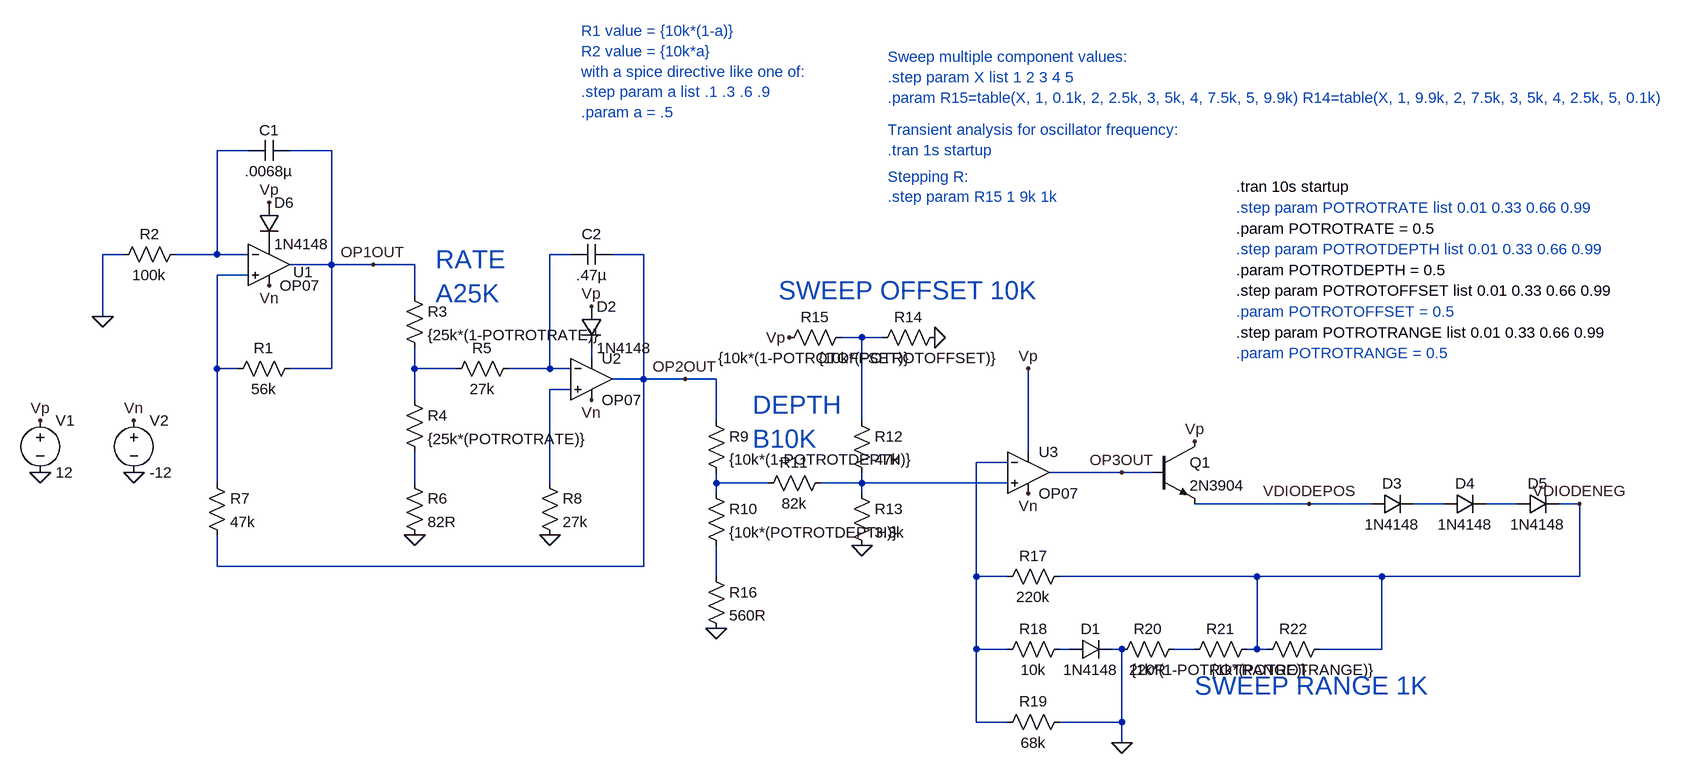
[diagram p0: schematic oscillator_fixed_extended.asc]
oscillator_fixed_extended.asc, the LTspice schematic file:
Version 4
SHEET 1 2688 968
WIRE 112 16 64 16
WIRE 240 16 176 16
WIRE -80 176 -112 176
WIRE 64 176 64 16
WIRE 64 176 0 176
WIRE 112 176 64 176
WIRE 608 176 576 176
WIRE 720 176 672 176
WIRE 240 192 240 16
WIRE 240 192 176 192
WIRE 304 192 240 192
WIRE 368 192 304 192
WIRE 112 208 64 208
WIRE 368 240 368 192
WIRE -112 272 -112 176
WIRE 1056 304 1024 304
WIRE 1088 304 1056 304
WIRE 640 336 640 320
WIRE 64 352 64 208
WIRE 96 352 64 352
WIRE 240 352 240 192
WIRE 240 352 176 352
WIRE 368 352 368 320
WIRE 432 352 368 352
WIRE 576 352 576 176
WIRE 576 352 512 352
WIRE 608 352 576 352
WIRE 720 368 720 176
WIRE 720 368 672 368
WIRE 784 368 720 368
WIRE 832 368 784 368
WIRE 608 384 576 384
WIRE 368 400 368 352
WIRE 832 432 832 368
WIRE 1056 432 1056 304
WIRE 1312 480 1312 352
WIRE 1280 496 1232 496
WIRE 1456 512 1344 512
WIRE 1504 512 1456 512
WIRE 64 528 64 352
WIRE 368 528 368 480
WIRE 576 528 576 384
WIRE 832 528 832 512
WIRE 912 528 832 528
WIRE 1056 528 1056 512
WIRE 1056 528 992 528
WIRE 1280 528 1056 528
WIRE 832 544 832 528
WIRE 1056 544 1056 528
WIRE 1744 560 1568 560
WIRE 1840 560 1744 560
WIRE 1952 560 1904 560
WIRE 2064 560 2016 560
WIRE 2160 560 2128 560
WIRE 64 656 64 608
WIRE 720 656 720 368
WIRE 720 656 64 656
WIRE 832 672 832 624
WIRE 1232 672 1232 496
WIRE 1280 672 1232 672
WIRE 1664 672 1360 672
WIRE 1856 672 1664 672
WIRE 2160 672 2160 560
WIRE 2160 672 1856 672
WIRE 1232 784 1232 672
WIRE 1280 784 1232 784
WIRE 1376 784 1360 784
WIRE 1456 784 1440 784
WIRE 1568 784 1536 784
WIRE 1664 784 1664 672
WIRE 1664 784 1648 784
WIRE 1680 784 1664 784
WIRE 1856 784 1856 672
WIRE 1856 784 1760 784
WIRE 1232 896 1232 784
WIRE 1280 896 1232 896
WIRE 1456 896 1456 784
WIRE 1456 896 1360 896
WIRE 1456 928 1456 896
FLAG -112 272 0
FLAG 368 608 0
FLAG 576 608 0
FLAG -208 432 Vp
FLAG 144 96 Vp
FLAG 640 256 Vp
FLAG -64 432 Vn
FLAG 144 224 Vn
FLAG 640 400 Vn
FLAG -64 512 0
FLAG -208 512 0
FLAG 832 752 0
FLAG 1056 624 0
FLAG 1168 304 0
FLAG 944 304 Vp
FLAG 1312 352 Vp
FLAG 1568 464 Vp
FLAG 1312 544 Vn
FLAG 1456 928 0
FLAG 304 192 OP1OUT
FLAG 784 368 OP2OUT
FLAG 1456 512 OP3OUT
FLAG 1744 560 VDIODEPOS
FLAG 2160 560 VDIODENEG
SYMBOL Opamps\\OP07 144 128 R0
WINDOW 0 37 75 Left 2
SYMATTR InstName U1
SYMBOL cap 176 0 R90
WINDOW 0 0 32 VBottom 2
WINDOW 3 32 32 VTop 2
SYMATTR InstName C1
SYMATTR Value .0068µ
SYMBOL res 192 336 R90
WINDOW 0 0 56 VBottom 2
WINDOW 3 32 56 VTop 2
SYMATTR InstName R1
SYMATTR Value 56k
SYMBOL res 16 160 R90
WINDOW 0 0 56 VBottom 2
WINDOW 3 32 56 VTop 2
SYMATTR InstName R2
SYMATTR Value 100k
SYMBOL res 352 224 R0
SYMATTR InstName R3
SYMATTR Value {25k*(1-POTROTRATE)}
SYMBOL res 352 384 R0
SYMATTR InstName R4
SYMATTR Value {25k*(POTROTRATE)}
SYMBOL res 528 336 R90
WINDOW 0 0 56 VBottom 2
WINDOW 3 32 56 VTop 2
SYMATTR InstName R5
SYMATTR Value 27k
SYMBOL res 352 512 R0
SYMATTR InstName R6
SYMATTR Value 82R
SYMBOL Opamps\\OP07 640 304 R0
SYMATTR InstName U2
SYMBOL cap 672 160 R90
WINDOW 0 0 32 VBottom 2
WINDOW 3 32 32 VTop 2
SYMATTR InstName C2
SYMATTR Value .47µ
SYMBOL res 48 512 R0
SYMATTR InstName R7
SYMATTR Value 47k
SYMBOL res 560 512 R0
SYMATTR InstName R8
SYMATTR Value 27k
SYMBOL voltage -208 416 R0
WINDOW 123 0 0 Left 0
WINDOW 39 0 0 Left 0
SYMATTR InstName V1
SYMATTR Value 12
SYMBOL voltage -64 416 R0
SYMATTR InstName V2
SYMATTR Value -12
SYMBOL res 816 416 R0
SYMATTR InstName R9
SYMATTR Value {10k*(1-POTROTDEPTH)}
SYMBOL res 816 528 R0
SYMATTR InstName R10
SYMATTR Value {10k*(POTROTDEPTH)}
SYMBOL res 1008 512 R90
WINDOW 0 0 56 VBottom 2
WINDOW 3 32 56 VTop 2
SYMATTR InstName R11
SYMATTR Value 82k
SYMBOL res 1040 416 R0
SYMATTR InstName R12
SYMATTR Value 47k
SYMBOL res 1040 528 R0
SYMATTR InstName R13
SYMATTR Value 3.3k
SYMBOL res 1184 288 R90
WINDOW 0 0 56 VBottom 2
WINDOW 3 32 56 VTop 2
SYMATTR InstName R14
SYMATTR Value {10k*(POTROTOFFSET)}
SYMBOL res 1040 288 R90
WINDOW 0 0 56 VBottom 2
WINDOW 3 32 56 VTop 2
SYMATTR InstName R15
SYMATTR Value {10k*(1-POTROTOFFSET)}
SYMBOL res 816 656 R0
SYMATTR InstName R16
SYMATTR Value 560R
SYMBOL Opamps\\OP07 1312 448 R0
SYMATTR InstName U3
SYMBOL npn 1504 464 R0
SYMATTR InstName Q1
SYMATTR Value 2N3904
SYMBOL res 1376 656 R90
WINDOW 0 0 56 VBottom 2
WINDOW 3 32 56 VTop 2
SYMATTR InstName R17
SYMATTR Value 220k
SYMBOL res 1376 768 R90
WINDOW 0 0 56 VBottom 2
WINDOW 3 32 56 VTop 2
SYMATTR InstName R18
SYMATTR Value 10k
SYMBOL res 1376 880 R90
WINDOW 0 0 56 VBottom 2
WINDOW 3 32 56 VTop 2
SYMATTR InstName R19
SYMATTR Value 68k
SYMBOL res 1552 768 R90
WINDOW 0 0 56 VBottom 2
WINDOW 3 32 56 VTop 2
SYMATTR InstName R20
SYMATTR Value 220R
SYMBOL res 1664 768 R90
WINDOW 0 0 56 VBottom 2
WINDOW 3 32 56 VTop 2
SYMATTR InstName R21
SYMATTR Value {1k*(1-POTROTRANGE)}
SYMBOL res 1776 768 R90
WINDOW 0 0 56 VBottom 2
WINDOW 3 32 56 VTop 2
SYMATTR InstName R22
SYMATTR Value {1k*(POTROTRANGE)}
SYMBOL diode 1376 800 R270
WINDOW 0 32 32 VTop 2
WINDOW 3 0 32 VBottom 2
SYMATTR InstName D1
SYMATTR Value 1N4148
SYMBOL diode 1840 576 R270
WINDOW 0 32 32 VTop 2
WINDOW 3 0 32 VBottom 2
SYMATTR InstName D3
SYMATTR Value 1N4148
SYMBOL diode 1952 576 R270
WINDOW 0 32 32 VTop 2
WINDOW 3 0 32 VBottom 2
SYMATTR InstName D4
SYMATTR Value 1N4148
SYMBOL diode 2064 576 R270
WINDOW 0 32 32 VTop 2
WINDOW 3 0 32 VBottom 2
SYMATTR InstName D5
SYMATTR Value 1N4148
SYMBOL diode 624 256 R0
SYMATTR InstName D2
SYMATTR Value 1N4148
SYMBOL diode 128 96 R0
SYMATTR InstName D6
SYMATTR Value 1N4148
TEXT 1096 -16 Left 2 ;Transient analysis for oscillator frequency:\n.tran 1s startup
TEXT 1096 56 Left 2 ;Stepping R:\n.step param R15 1 9k 1k
TEXT 1632 72 Left 2 !.tran 10s startup
TEXT 1096 -128 Left 2 ;Sweep multiple component values:\n.step param X list 1 2 3 4 5\n.param R15=table(X, 1, 0.1k, 2, 2.5k, 3, 5k, 4, 7.5k, 5, 9.9k) R14=table(X, 1, 9.9k, 2, 7.5k, 3, 5k, 4, 2.5k, 5, 0.1k)
TEXT 928 232 Left 4 ;SWEEP OFFSET 10K
TEXT 1568 840 Left 4 ;SWEEP RANGE 1K
TEXT 400 184 Left 4 ;RATE \nA25K
TEXT 888 408 Left 4 ;DEPTH\nB10K
TEXT 624 -168 Left 2 ;R1 value = {10k*(1-a)}\nR2 value = {10k*a}\nwith a spice directive like one of:\n.step param a list .1 .3 .6 .9\n.param a = .5
TEXT 1632 104 Left 2 ;.step param POTROTRATE list 0.01 0.33 0.66 0.99
TEXT 1632 136 Left 2 !.param POTROTRATE = 0.5
TEXT 1632 168 Left 2 ;.step param POTROTDEPTH list 0.01 0.33 0.66 0.99
TEXT 1632 200 Left 2 !.param POTROTDEPTH = 0.5
TEXT 1632 232 Left 2 !.step param POTROTOFFSET list 0.01 0.33 0.66 0.99
TEXT 1632 264 Left 2 ;.param POTROTOFFSET = 0.5
TEXT 1632 296 Left 2 !.step param POTROTRANGE list 0.01 0.33 0.66 0.99
TEXT 1632 328 Left 2 ;.param POTROTRANGE = 0.5

The netlist it stands for:
* oscillator_fixed_extended.asc
XU1 N003 N001 P001 Vn OP1OUT LT1001  ; OP07, pins In+ In- V+ V- OUT
C1 OP1OUT N001 .0068µ
R1 OP1OUT N003 56k
R2 N001 0 100k
R3 OP1OUT N006 {25k*(1-POTROTRATE)}
R4 N006 N009 {25k*(POTROTRATE)}
R5 N002 N006 27k
R6 N009 0 82R
XU2 N007 N002 N005 Vn OP2OUT LT1001  ; OP07, pins In+ In- V+ V- OUT
C2 OP2OUT N002 .47µ
R7 N003 OP2OUT 47k
R8 N007 0 27k
V1 Vp 0 12
V2 Vn 0 -12
R9 OP2OUT N010 {10k*(1-POTROTDEPTH)}
R10 N010 N014 {10k*(POTROTDEPTH)}
R11 N011 N010 82k
R12 N004 N011 47k
R13 N011 0 3.3k
R14 0 N004 {10k*(POTROTOFFSET)}
R15 N004 Vp {10k*(1-POTROTOFFSET)}
R16 N014 0 560R
XU3 N011 N008 Vp Vn OP3OUT LT1001  ; OP07, pins In+ In- V+ V- OUT
Q1 Vp OP3OUT VDIODEPOS 0 2N3904
R17 VDIODENEG N008 220k
R18 N015 N008 10k
R19 0 N008 68k
R20 N016 0 220R
R21 VDIODENEG N016 {1k*(1-POTROTRANGE)}
R22 VDIODENEG VDIODENEG {1k*(POTROTRANGE)}
D1 N015 0 1N4148
D3 VDIODEPOS N012 1N4148
D4 N012 N013 1N4148
D5 N013 VDIODENEG 1N4148
D2 Vp N005 1N4148
D6 Vp P001 1N4148
.model D D
.lib standard.dio
.model NPN NPN
.model PNP PNP
.lib standard.bjt
* Transient analysis for oscillator frequency:
* .tran 1s startup
* Stepping R:
* .step param R15 1 9k 1k
.tran 10s startup
* Sweep multiple component values:
* .step param X list 1 2 3 4 5
* .param R15=table(X, 1, 0.1k, 2, 2.5k, 3, 5k, 4, 7.5k, 5, 9.9k) R14=table(X, 1, 9.9k, 2, 7.5k, 3, 5k, 4, 2.5k, 5, 0.1k)
* SWEEP OFFSET 10K
* SWEEP RANGE 1K
* RATE
* A25K
* DEPTH
* B10K
* R1 value = {10k*(1-a)}
* R2 value = {10k*a}
* with a spice directive like one of:
* .step param a list .1 .3 .6 .9
* .param a = .5
* .step param POTROTRATE list 0.01 0.33 0.66 0.99
.param POTROTRATE = 0.5
* .step param POTROTDEPTH list 0.01 0.33 0.66 0.99
.param POTROTDEPTH = 0.5
.step param POTROTOFFSET list 0.01 0.33 0.66 0.99
* .param POTROTOFFSET = 0.5
.step param POTROTRANGE list 0.01 0.33 0.66 0.99
* .param POTROTRANGE = 0.5
.lib LTC.lib
.backanno
.end